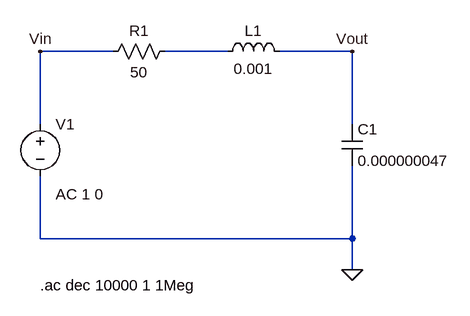
[diagram p0: schematic Pasa_Bajos.asc]
Pasa_Bajos.asc, the LTspice schematic file:
Version 4
SHEET 1 880 680
WIRE 128 0 16 0
WIRE 304 0 208 0
WIRE 496 0 384 0
WIRE 16 112 16 0
WIRE 496 112 496 0
WIRE 16 288 16 192
WIRE 496 288 496 176
WIRE 496 288 16 288
WIRE 496 336 496 288
FLAG 496 336 0
FLAG 496 0 Vout
FLAG 16 0 Vin
SYMBOL voltage 16 96 R0
WINDOW 123 24 124 Left 2
WINDOW 39 0 0 Left 0
SYMATTR Value2 AC 1 0
SYMATTR InstName V1
SYMATTR Value ""
SYMBOL res 224 -16 R90
WINDOW 0 0 56 VBottom 2
WINDOW 3 32 56 VTop 2
SYMATTR InstName R1
SYMATTR Value 50
SYMBOL ind 288 16 R270
WINDOW 0 32 56 VTop 2
WINDOW 3 5 56 VBottom 2
SYMATTR InstName L1
SYMATTR Value 0.001
SYMBOL cap 480 112 R0
SYMATTR InstName C1
SYMATTR Value 0.000000047
TEXT 16 360 Left 2 !.ac dec 10000 1 1Meg

The netlist it stands for:
* Pasa_Bajos.asc
V1 Vin 0 AC 1 0
R1 N001 Vin 50
L1 N001 Vout 0.001
C1 Vout 0 0.000000047
.ac dec 10000 1 1Meg
.backanno
.end